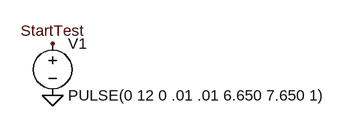
[diagram p0: schematic PredictionLabel.asc]
PredictionLabel.asc, the LTspice schematic file:
Version 4
SHEET 1 880 680
FLAG 80 240 0
FLAG 80 160 StartTest
SYMBOL voltage 80 144 R0
WINDOW 123 0 0 Left 2
WINDOW 39 0 0 Left 2
SYMATTR InstName V1
SYMATTR Value PULSE(0 12 0 .01 .01 6.650 7.650 1)

The netlist it stands for:
* PredictionLabel.asc
V1 StartTest 0 PULSE(0 12 0 .01 .01 6.650 7.650 1)
.backanno
.end